# EAGLE design Zio Eink Display 1.54 (EAGLE 8.6.1)
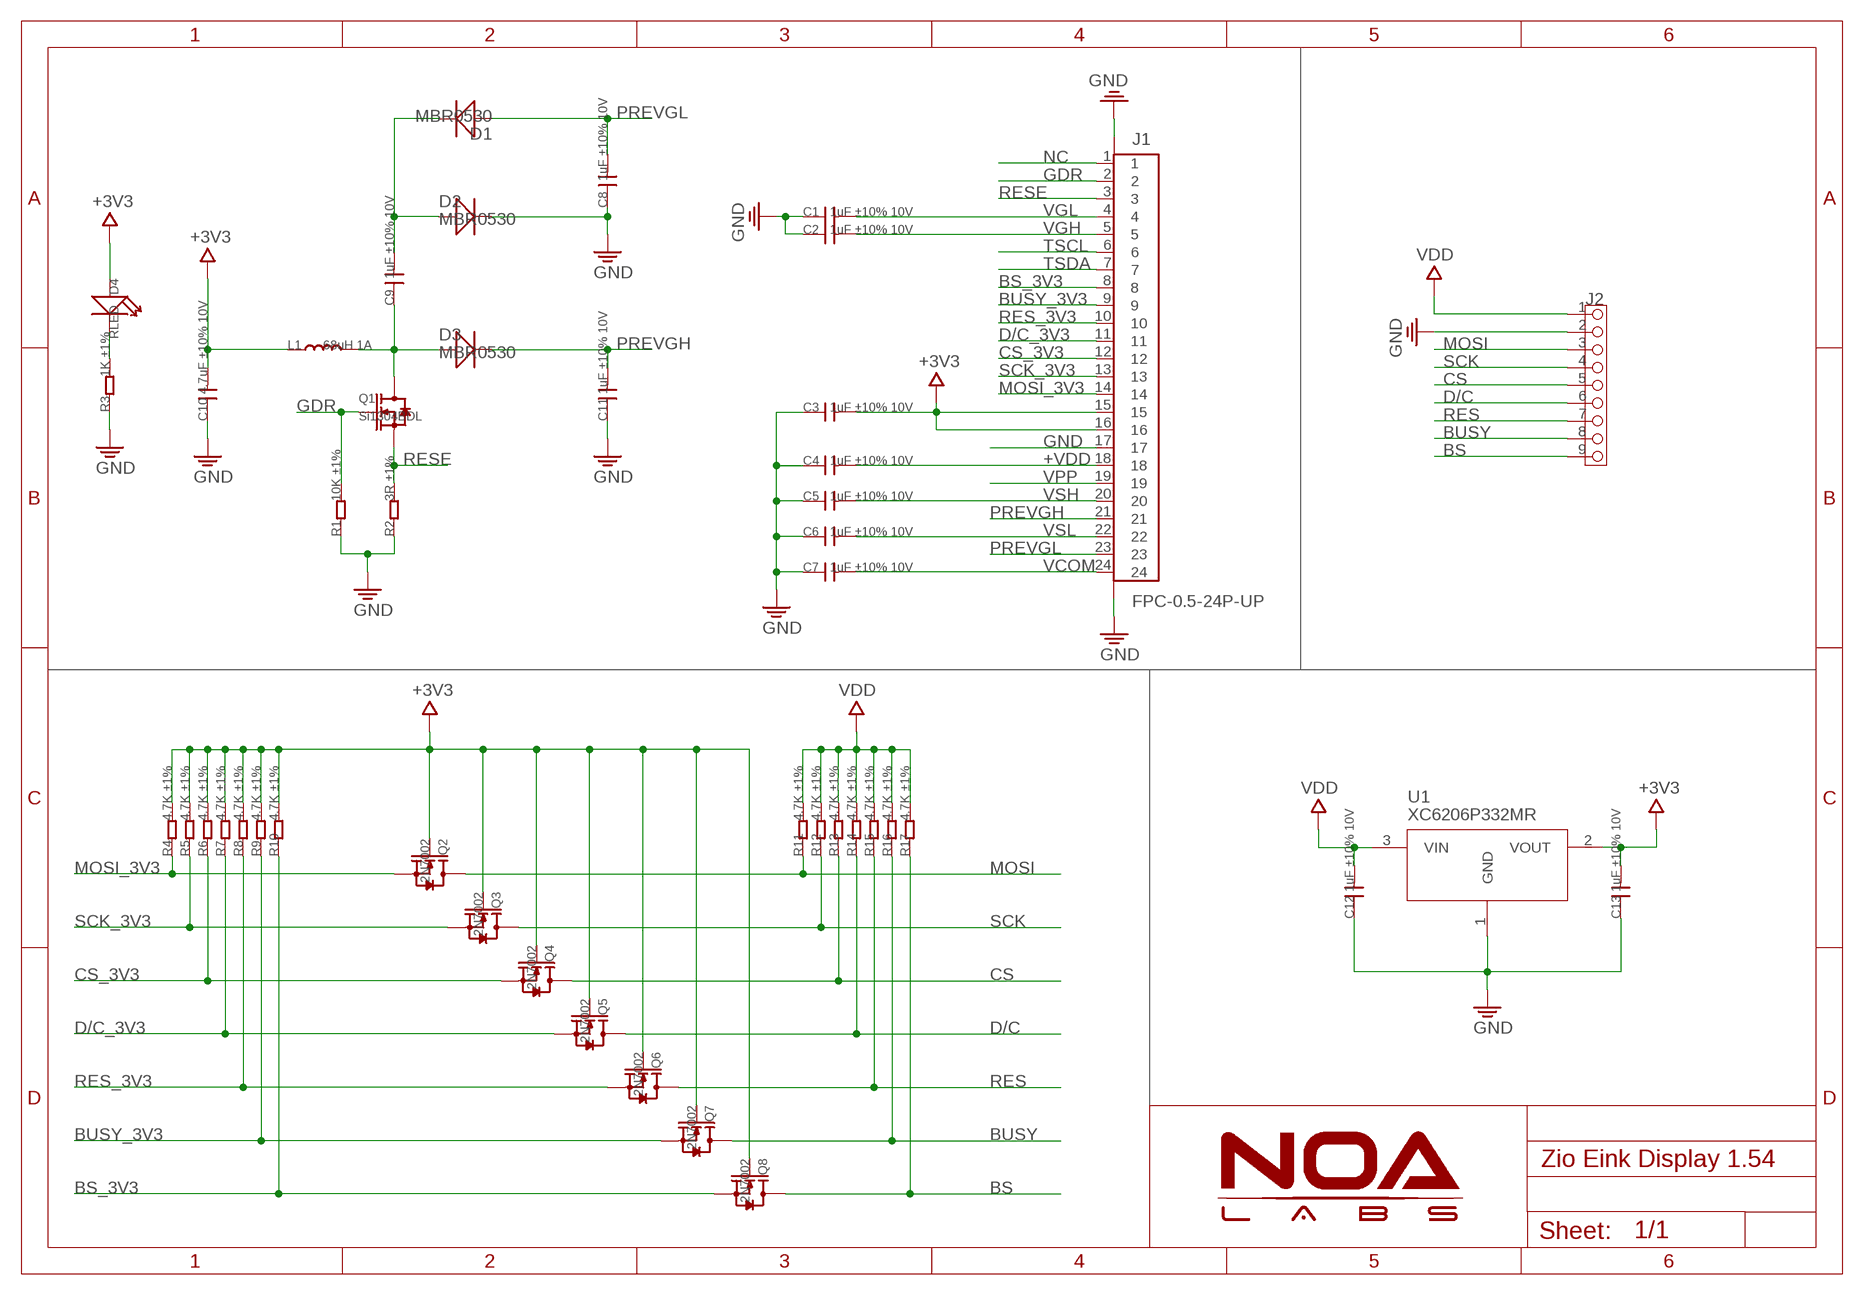
[diagram p0: schematic, sheet 1]

## Parts
C1  1uF ±10% 10V  C-0603  [0603]
C2  1uF ±10% 10V  C-0603  [0603]
C3  1uF ±10% 10V  C-0603  [0603]
C4  1uF ±10% 10V  C-0603  [0603]
C5  1uF ±10% 10V  C-0603  [0603]
C6  1uF ±10% 10V  C-0603  [0603]
C7  1uF ±10% 10V  C-0603  [0603]
C8  1uF ±10% 10V  C-0603  [0603]
C9  1uF ±10% 10V  C-0603  [0603]
C10  4.7uF ±10% 10V  C-0603  [0603]
C11  1uF ±10% 10V  C-0603  [0603]
C12  1uF ±10% 10V  C-0603  [0603]
C13  1uF ±10% 10V  C-0603  [0603]
D1  MBR0530  D'1206'  [SOD123]
D2  MBR0530  D'1206'  [SOD123]
D3  MBR0530  D'1206'  [SOD123]
D4  RLED  LED'0603'  [LED-0603]
J1  FPC-0.5-24P-UP  [FPC-0.5-24P_UP]
J2  HEADER-9P2.54  [9P-2.54-SMD]
L1  68uH 1A  L  [L3012]
Q1  Si1304BDL  MOSFET-N-323  [SOT-323]
Q2  2N7002  MOSFET-N-SOT23  [SOT23]
Q3  2N7002  MOSFET-N-SOT23  [SOT23]
Q4  2N7002  MOSFET-N-SOT23  [SOT23]
Q5  2N7002  MOSFET-N-SOT23  [SOT23]
Q6  2N7002  MOSFET-N-SOT23  [SOT23]
Q7  2N7002  MOSFET-N-SOT23  [SOT23]
Q8  2N7002  MOSFET-N-SOT23  [SOT23]
R1  10K ±1%  R-0603  [0603]
R2  3R ±1%  R-0603  [0603]
R3  1K ±1%  R-0402  [0402]
R4  4.7K ±1%  R-0402  [0402]
R5  4.7K ±1%  R-0402  [0402]
R6  4.7K ±1%  R-0402  [0402]
R7  4.7K ±1%  R-0402  [0402]
R8  4.7K ±1%  R-0402  [0402]
R9  4.7K ±1%  R-0402  [0402]
R10  4.7K ±1%  R-0402  [0402]
R11  4.7K ±1%  R-0402  [0402]
R12  4.7K ±1%  R-0402  [0402]
R13  4.7K ±1%  R-0402  [0402]
R14  4.7K ±1%  R-0402  [0402]
R15  4.7K ±1%  R-0402  [0402]
R16  4.7K ±1%  R-0402  [0402]
R17  4.7K ±1%  R-0402  [0402]
U1  XC6206P332MR  XC6206MR  [SOT23]

## Nets
+3V3: C3.2 C10.2 C13.2 D4.+ J1.15 J1.16 L1.P$1 Q2.1(G) Q3.1(G) Q4.1(G) Q5.1(G) Q6.1(G) Q7.1(G) Q8.1(G) R4.2 R5.2 R6.2 R7.2 R8.2 R9.2 R10.2 U1.2(VOUT)
+VDD: C4.2 J1.18
BS: J2.9 Q8.3(D) R17.1
BS_3V3: J1.8 Q8.2(S) R10.1
BUSY: J2.8 Q7.3(D) R16.1
BUSY_3V3: J1.9 Q7.2(S) R9.1
CS: J2.5 Q4.3(D) R13.1
CS_3V3: J1.12 Q4.2(S) R6.1
D/C: J2.6 Q5.3(D) R14.1
D/C_3V3: J1.11 Q5.2(S) R7.1
GDR: J1.2 Q1.1(G) R1.2
GND: C1.1 C2.1 C3.1 C4.1 C5.1 C6.1 C7.1 C8.1 C10.1 C11.1 C12.1 C13.1 D2.- J1.17 J1.25(G1) J1.26(G2) J2.2 R1.1 R2.1 R3.1 U1.1(GND)
MOSI: J2.3 Q2.3(D) R11.1
MOSI_3V3: J1.14 Q2.2(S) R4.1
N$2: C9.2 D1.- D2.+
N$3: C9.1 D3.+ L1.P$2 Q1.3(D)
N$7: D4.- R3.2
NC: J1.1
PREVGH: C11.2 D3.- J1.21
PREVGL: C8.2 D1.+ J1.23
RES: J2.7 Q6.3(D) R15.1
RES_3V3: J1.10 Q6.2(S) R8.1
RESE: J1.3 Q1.2(S) R2.2
SCK: J2.4 Q3.3(D) R12.1
SCK_3V3: J1.13 Q3.2(S) R5.1
TSCL: J1.6
TSDA: J1.7
VCOM: C7.2 J1.24
VDD: C12.2 J2.1 R11.2 R12.2 R13.2 R14.2 R15.2 R16.2 R17.2 U1.3(VIN)
VGH: C2.2 J1.5
VGL: C1.2 J1.4
VPP: J1.19
VSH: C5.2 J1.20
VSL: C6.2 J1.22

## Library data of the parts
C1-C13 = Discretex:C*: Ceramic Capacitors
D1-D3 = Discretex:D*
D4 = Discretex:LED*
J1 = Connector:FPC-0.5-24P
J2 = Connector:HEADER-9P
L1 = Discretex:L*
Q1-Q8 = Discretex:MOSFET-N
R1-R17 = Discretex:R*
U1 = IC:XC6206MR

## Board
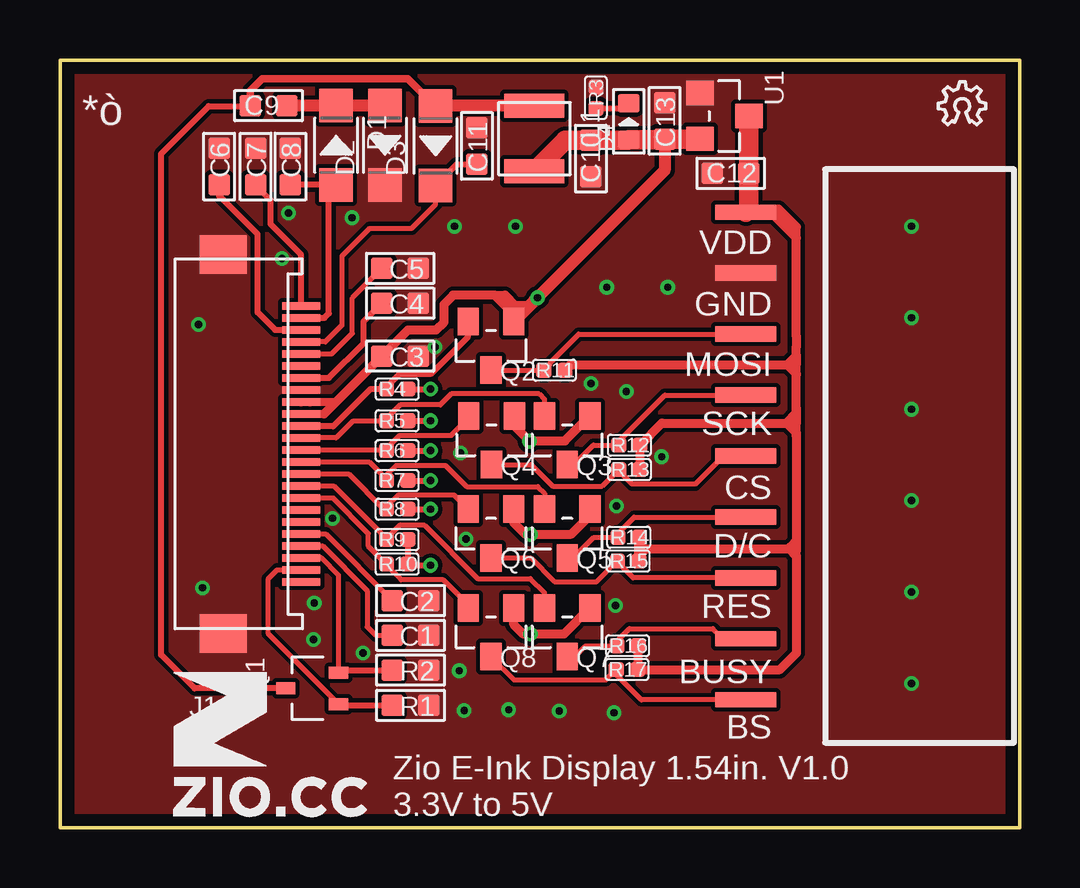
[diagram p1: board, top side]
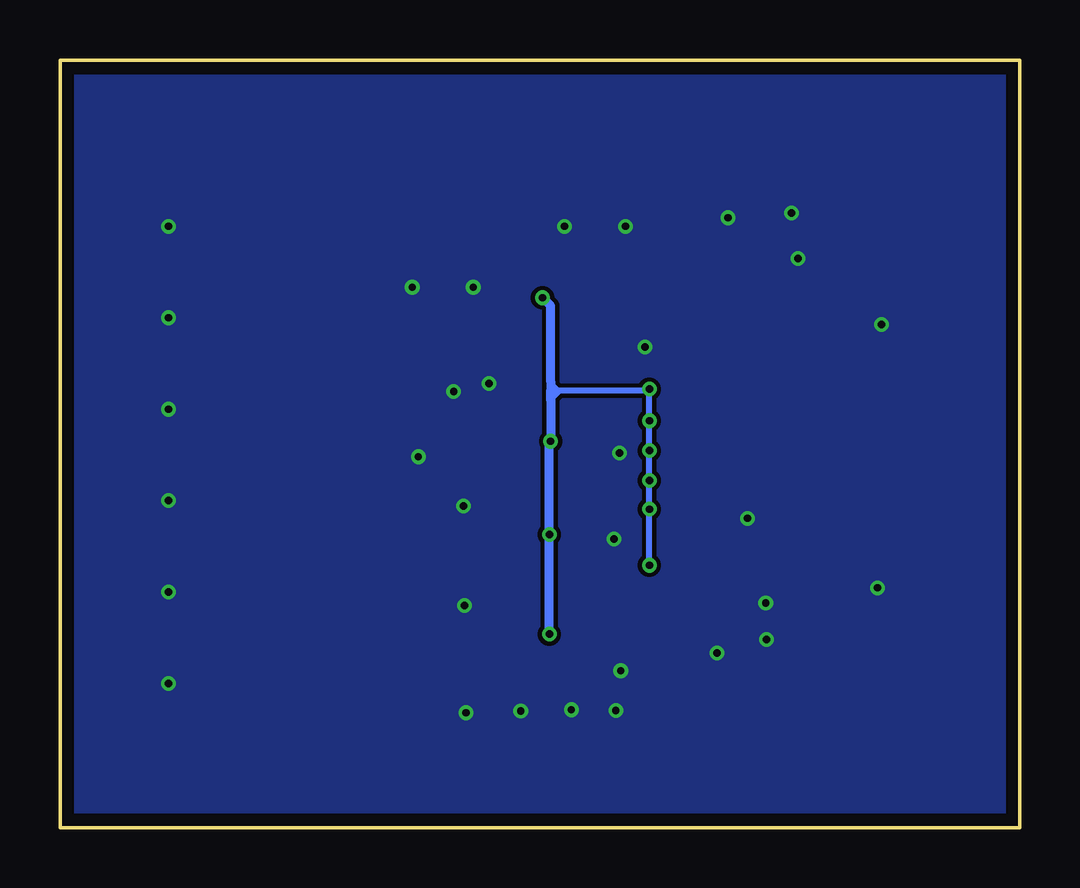
[diagram p2: board, bottom side, seen from below]

Size 40 x 32 mm. Coordinates in mm from the lower left corner, seen from the top.
Outline: 0,0 40,0 40,32 0,32 0,0
Copper layers (1*16): Top 0.035mm / dielectric 1.5mm / Bottom 0.035mm
Design rules "NOA Eagle Rule": minimum track width 7mil, minimum drill 12mil, track to track 7mil, track to pad 7mil, pad to pad 7mil, via to via 7mil, smd to smd 0mil, copper to edge 20mil, drill to drill 10mil, minimum pad ring 10mil, minimum via ring 6mil, stop-mask expansion 2mil, vias tented up to drill 25mil, thermal gap 10mil

### Footprints (pad centres in the part's own frame; a part is rotated, then mirrored left to right if it is on the bottom)
0603 = smd 0.889 x 0.889: 1 -0.762,0; 2 0.762,0
SOD123 = smd 1.397 x 1.397: + 1.651,0; - -1.651,0
LED-0603 = smd 0.762 x 0.889: + -0.762,0; - 0.762,0
FPC-0.5-24P_UP = smd 0.3 x 1.6: 1 -5.75,-0.05; 2 -5.25,-0.05; 3 -4.75,-0.05; 4 -4.25,-0.05; 5 -3.75,-0.05; 6 -3.25,-0.05; 7 -2.75,-0.05; 8 -2.25,-0.05; 9 -1.75,-0.05; 10 -1.25,-0.05; 11 -0.75,-0.05; 12 -0.25,-0.05; 13 0.25,-0.05; 14 0.75,-0.05; 15 1.25,-0.05; 16 1.75,-0.05; 17 2.25,-0.05; 18 2.75,-0.05; 19 3.25,-0.05; 20 3.75,-0.05; 21 4.25,-0.05; 22 4.75,-0.05; 23 5.25,-0.05; 24 5.75,-0.05 | smd 1.6 x 1.95: 25 7.9,3.2; 26 -7.9,3.2
9P-2.54-SMD = smd 2.54 x 0.635: 1 0,10.16; 2 0,7.62; 3 0,5.08; 4 0,2.54; 5 0,0; 6 0,-2.54; 7 0,-5.08; 8 0,-7.62; 9 0,-10.16
L3012 = smd 2.5 x 1: P$1 0,1.373; P$2 0,-1.373
SOT-323 = smd 0.5 x 0.8: 1 0.65,0; 2 -0.65,0; 3 0,-2.2
SOT23 = smd 0.889 x 1.143: 1 -0.95,-1.016; 2 0.95,-1.016; 3 0,1.016
0402 = smd 0.635 x 0.635: 1 -0.445,0; 2 0.445,0
SOT23' = smd 1.016 x 1.143: 1 -0.95,-1.016; 2 0.95,-1.016; 3 0,1.016

### Placement (x,y rotation side)
C1  14.61,8.03 180 top
C2  14.61,9.47 180 top
C3  14.17,19.66 180 top
C4  14.17,21.87 180 top
C5  14.17,23.32 180 top
C6  6.63,27.56 270 top
C7  8.15,27.56 270 top
C8  9.6,27.56 270 top
C9  8.69,30.1 0 top
C10  22.12,27.89 90 top
C11  17.37,28.42 270 top
C12  27.94,27.28 0 top
C13  25.2,29.46 270 top
D1  11.51,28.45 270 top
D2  13.54,28.45 90 top
D3  15.65,28.42 90 top
D4  23.7,29.44 90 top
J1  10,16 90 top
J2  28.57,15.5 0 top
L1  19.76,28.73 180 top
Q1  11.61,5.82 270 top
Q2  17.96,20.09 180 top
Q3  21.13,16.15 180 top
Q4  17.98,16.15 180 top
Q5  21.13,12.27 180 top
Q6  17.96,12.27 180 top
Q7  21.13,8.15 180 top
Q8  17.96,8.15 180 top
R1  14.61,5.11 180 top
R2  14.61,6.58 180 top
R3  22.33,30.43 270 top
R4  14.05,18.29 0 top
R5  14.05,16.97 0 top
R6  14.05,15.72 0 top
R7  14.05,14.48 0 top
R8  14.05,13.28 0 top
R9  14.05,12.01 0 top
R10  14.05,11 0 top
R11  20.6,19.08 0 top
R12  23.72,15.95 0 top
R13  23.72,14.94 0 top
R14  23.7,12.12 0 top
R15  23.67,11.13 0 top
R16  23.65,7.59 0 top
R17  23.62,6.6 0 top
U1  XC6206P332MR  [SOT23']  27.69,29.67 270 top
U$9  [6MM]  4.7,0.48 0 top
U$10  [OSHW_6X70_NOTEXT]  36.6,29.31 0 top

### Tracks (layer width: path | path; a pad name or v marks a point on that pad's centre or on a via)
+3V3  (via drill 0.3)
  Top 0.203: v19.56,16.12 19.75,16.12 19.76,16.13
  Top 0.254: R4.2 v15.44,18.29 | R5.2 v15.44,16.97 | R6.2 v15.44,15.72 | R7.2 v15.44,14.48 | R8.2 v15.44,13.28 | R9.2 R10.2 14.54,10.95 v15.44,10.95 | J1.16 10.07,17.73 10.41,17.73
  Top 0.33: 11.48,17.73 10.41,17.73 10.05,17.73 | J1.15 11,17.25
  Top 0.381: Q8.1 18.91,8.47 19.3,8.08 v19.61,8.08 20.99,8.08 Q7.1 | Q6.1 18.91,12.71 19.38,12.24 19.61,12.24 | 19.61,12.24 21.31,12.24 22.08,13.02 Q5.1 | Q4.1 18.93,16.75 v19.56,16.13 19.76,16.13 21.04,16.13 Q3.1 | 18.11,22.2 16.38,22.2 16,21.82 16,21.08 15.67,20.75 14.5,20.75 C3.2 11.48,17.73 11,17.25 | 18.11,22.2 18.54,22.2 18.98,21.76 | 18.98,21.76 19.26,21.48 19.26,21.46 | 19.56,21.76 18.98,21.76 | Q2.1 18.91,21.4 18.11,22.2 | v19.61,12.23 19.61,12.24
  Top 0.508: C13.2 25.2,27.4 v19.89,22.09 19.56,21.76 19.26,21.46 Q2.1
  Top 0.813: L1.P$1 21.06,28.65 C10.2 23.67,28.65 D4.+ 25.17,28.68 C13.2 26.66,28.7 U1.2
  Bottom 0.254: v15.44,10.95 v15.44,13.28 v15.44,14.48 v15.44,15.72 v15.44,16.97 v15.44,18.29 15.52,18.21 19.25,18.21 | 19.25,18.21 19.56,18.21 | 19.25,18.21 19.56,18.52 19.56,18.62 | 19.25,18.21 19.25,18.16 19.56,17.86
  Bottom 0.381: v19.61,8.08 v19.61,12.23 19.61,16.07 v19.56,16.12 19.56,17.86 19.56,18.21 19.56,18.62 19.56,21.76 v19.89,22.09
+VDD
  Top 0.254: C4.2 12.65,21.11 12.65,20.2 11.2,18.75 J1.18
BS
  Top 0.203: Q8.3 18.92,6.17 22.75,6.17 23.07,6.5 | 23.07,6.5 R17.1 | J2.9 24.23,5.34 23.07,6.5
BS_3V3
  Top 0.203: Q8.2 17.01,9.31 15.98,10.34 14.21,10.34 13.6,10.95 R10.1 12.85,11.75 12.85,12.26 11.37,13.75 J1.8
BUSY
  Top 0.203: Q7.3 21.44,7.14 21.87,7.57 23.18,7.57 R16.1 23.2,7.79 23.72,8.31 27.2,8.31 27.51,8 28.45,8 J2.8
BUSY_3V3
  Top 0.203: Q7.2 20.18,9.81 19.6,10.39 17.41,10.39 15.19,12.61 14.15,12.61 13.74,12.21 | 13.74,12.21 13.6,12.21 | 13.74,12.21 13.6,12.06 R9.1 13.46,12.01 13.46,12.19 11.4,14.25 J1.9
CS
  Top 0.203: Q4.3 19.63,15.14 20.52,14.25 22.59,14.25 R13.1 23.43,14.79 23.43,14.74 23.84,14.33 26.47,14.33 27.64,15.49 J2.5
CS_3V3
  Top 0.203: 17.03,17.08 16.31,16.36 14.15,16.36 13.6,15.81 R6.1 13.57,15.75 J1.12
  Top 0.254: 17.03,17.08 Q4.2
D/C
  Top 0.203: Q5.3 21.39,11.25 22.23,12.09 23.23,12.09 R14.1 23.25,12.28 23.93,12.95 J2.6
D/C_3V3
  Top 0.203: R7.1 13.38,14.75 12.88,15.25 J1.11 | 20.19,13.29 20.19,13.95 19.91,14.22 16.94,14.22 16.07,15.1 14.01,15.1 13.6,14.69
  Top 0.254: 13.6,14.69 R7.1 | 20.19,13.29 Q5.2
GDR
  Top 0.203: J1.2 9.05,10.75 8.69,10.39 8.69,8.09 Q1.1
  Top 0.254: Q1.1 11.67,5.11 R1.2
GND  (via drill 0.3)
  other vias: 16.64,6.55 23.14,9.27 23.19,13.41 25.07,15.47 22.12,18.52 16.69,15.62 16.92,12.04 12.17,25.43 9.53,25.63 9.25,23.72 11.35,12.9 15.62,20.04 10.59,9.37 10.57,7.85 5.94,10.01 5.77,20.98 23.6,18.19 16.84,4.9 18.69,4.93 20.8,4.88 23.09,4.8 22.78,22.53 25.32,22.53 16.43,25.07 18.97,25.07 12.62,7.29 35.48,25.07 35.48,21.26 35.48,17.45 35.48,13.64 35.48,9.83 35.48,6.02
  pour Top (no thermals): 0,32 40.01,32 40.01,0 0,0
  pour Bottom (no thermals): 0,32 40.01,32 40.01,0 0,0
MOSI
  Top 0.203: Q2.3 R11.1 20.45,19.37 20.45,19.42 21.61,20.58 J2.3
MOSI_3V3
  Top 0.254: Q2.2 17.01,20.48 15.44,18.91 14.14,18.91 13.63,18.4 13.63,18.32 R4.1 12.93,18.29 11.38,16.74 J1.14
N$2
  Top 0.508: D2.+ D1.- C9.2
N$3
  Top 0.254: 15.67,30.1 D3.+ | Q1.3 5.61,5.82 4.22,7.21 4.22,28.09 6.2,30.07 7.9,30.07 C9.1
  Top 0.305: D3.+ 14.5,31.22 8.43,31.23 7.92,30.72 C9.1
  Top 0.508: L1.P$2 15.67,30.1
N$7
  Top 0.254: R3.2 23.48,29.98 D4.-
PREVGH
  Top 0.203: D3.- 15.65,25.98 14.65,24.99 12.91,24.99 11.75,23.82 11.75,20.94 11.05,20.25 J1.21
  Top 0.254: D3.- 16.54,27.66 C11.2
PREVGL
  Top 0.254: D1.+ C8.2 | 11.34,26.63 D1.+ | J1.23 11.01,21.25 11.2,21.44 11.2,26.49 D1.+
RES
  Top 0.203: Q6.3 19.61,11.25 20.6,10.26 22.36,10.26 R15.1 23.36,10.99 23.36,10.94 23.89,10.42 J2.7
RES_3V3
  Top 0.203: Q6.2 16.41,13.88 14.08,13.88 13.6,13.4 | 13.6,13.4 13.49,13.29 12.02,14.75 J1.10 | R8.1 13.6,13.4
  Top 0.254: 13.49,13.29 R8.1
RESE
  Top 0.203: J1.3 10.9,11.25 11.61,10.54 Q1.2
  Top 0.254: Q1.2 11.72,6.58 R2.2
SCK
  Top 0.203: Q3.3 21.41,15.14 22.23,15.95 R12.1 23.28,16.12 25.2,18.04 J2.4
SCK_3V3
  Top 0.203: Q3.2 20.18,17.87 19.96,18.09 16.31,18.09 15.85,17.63 14.18,17.63 13.7,17.15 | J1.13 11.5,16.25 12.19,16.94 13.58,16.94
  Top 0.254: 13.58,16.94 R5.1 13.7,17.06 13.7,17.15
VCOM
  Top 0.254: J1.24 10.05,23.88 8.76,25.17 8.76,26.19 C7.2
VDD
  Top 0.381: R16.2 24.07,7.57 R17.2 30,6.6 30.68,7.29 30.68,11.33 | R15.2 24.12,11.63 | 24.12,11.63 24.12,12.09 R14.2 | R13.2 R12.2 25.08,16.87 30.28,16.87 | R11.2 21.27,19.3 30.3,19.3 | 30.68,24.59 30.68,20.47 30.68,20.07 30.68,19.68 | 30.68,24.59 30.68,25.04 29.94,25.79 28.7,25.79 | J2.1 29.61,25.66 30.68,24.59 | 30.68,11.33 30.68,11.56 | 30.68,11.89 30.68,11.56 | 30.68,18.9 30.68,19.33 | 30.68,17.48 30.68,16.87 | 30.68,17.48 30.68,18.9 | 30.68,16.31 30.68,16.87 | 30.68,16.31 30.68,11.89 | 30.68,19.68 30.68,19.33 | 24.12,11.63 30.35,11.63 | 30.38,11.63 30.61,11.63 30.68,11.56 | 30.35,11.63 30.61,11.89 30.68,11.89 | 30.35,11.63 30.38,11.63 | 30.38,11.63 30.68,11.33 | 30.68,19.33 30.66,19.3 30.3,19.3 | 30.3,19.3 30.68,19.68 | 30.3,19.3 30.68,18.92 30.68,18.9 | 30.28,16.87 30.68,16.87 | 30.28,16.87 30.68,17.27 30.68,17.48 | 30.28,16.87 30.68,16.46 30.68,16.31
  Top 0.813: U1.3 C12.2 28.7,25.79 J2.1
VGH
  Top 0.203: J1.5 11.07,12.25 C2.2
VGL
  Top 0.203: C1.2 13.16,8.03 12.8,8.38 12.8,9.89 10.94,11.75 J1.4
  Top 0.254: C1.2 13.82,8.15
VSH
  Top 0.203: C5.2 12.18,22.09 12.18,20.61 11.32,19.75 J1.20
VSL
  Top 0.254: 6.6,26.77 C6.2 6.63,26.34 8.23,24.74 8.23,21.49 8.97,20.75 J1.22

### Text on the board
tPlace: *ò | VDD | GND | MOSI | SCK | CS | D/C | RES | BUSY | BS | Zio E-Ink Display 1.54in. V1.0 / 3.3V to 5V